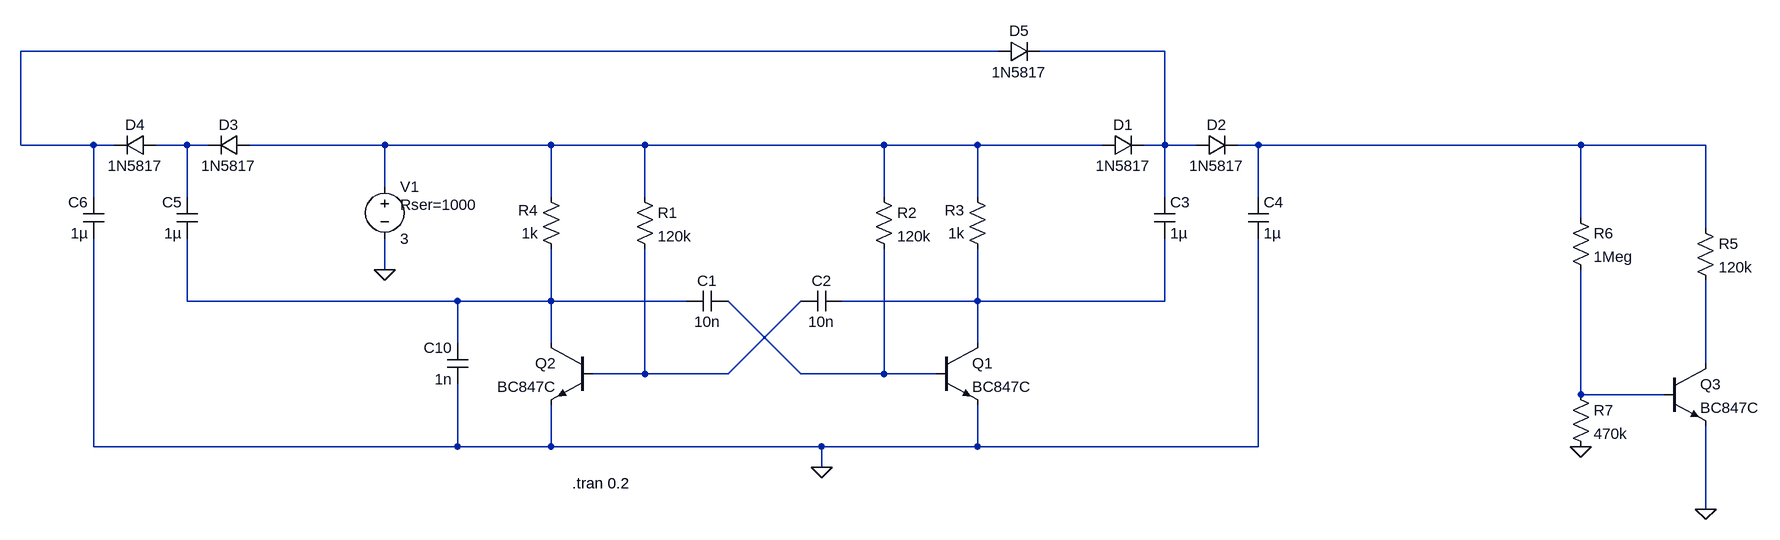
[diagram p0: schematic astableMultivibrator.asc]
astableMultivibrator.asc, the LTspice schematic file:
Version 4.1
SHEET 1 1956 680
WIRE 368 -336 -1136 -336
WIRE 624 -336 432 -336
WIRE -1136 -192 -1136 -336
WIRE -1024 -192 -1136 -192
WIRE -992 -192 -1024 -192
WIRE -880 -192 -928 -192
WIRE -848 -192 -880 -192
WIRE -576 -192 -784 -192
WIRE -320 -192 -576 -192
WIRE -176 -192 -320 -192
WIRE 192 -192 -176 -192
WIRE 336 -192 192 -192
WIRE 528 -192 336 -192
WIRE 624 -192 624 -336
WIRE 624 -192 592 -192
WIRE 672 -192 624 -192
WIRE 768 -192 736 -192
WIRE 1264 -192 768 -192
WIRE 1456 -192 1264 -192
WIRE -576 -128 -576 -192
WIRE -1024 -112 -1024 -192
WIRE -880 -112 -880 -192
WIRE -320 -112 -320 -192
WIRE -176 -112 -176 -192
WIRE 192 -112 192 -192
WIRE 336 -112 336 -192
WIRE 624 -112 624 -192
WIRE 768 -112 768 -192
WIRE 1264 -80 1264 -192
WIRE 1456 -64 1456 -192
WIRE -576 0 -576 -48
WIRE -880 48 -880 -48
WIRE -464 48 -880 48
WIRE -320 48 -320 -32
WIRE -320 48 -464 48
WIRE -112 48 -320 48
WIRE 336 48 336 -32
WIRE 336 48 128 48
WIRE 624 48 624 -48
WIRE 624 48 336 48
WIRE -464 112 -464 48
WIRE -320 112 -320 48
WIRE 336 112 336 48
WIRE 1456 144 1456 16
WIRE -176 160 -176 -32
WIRE -176 160 -256 160
WIRE -48 160 64 48
WIRE -48 160 -176 160
WIRE 64 160 -48 48
WIRE 192 160 192 -32
WIRE 192 160 64 160
WIRE 272 160 192 160
WIRE 1264 192 1264 0
WIRE 1392 192 1264 192
WIRE -1024 272 -1024 -48
WIRE -464 272 -464 176
WIRE -464 272 -1024 272
WIRE -320 272 -320 208
WIRE -320 272 -464 272
WIRE 96 272 -320 272
WIRE 336 272 336 208
WIRE 336 272 96 272
WIRE 768 272 768 -48
WIRE 768 272 336 272
WIRE 96 304 96 272
WIRE 1456 368 1456 240
FLAG 96 304 0
FLAG -576 0 0
FLAG 1456 368 0
FLAG 1264 272 0
SYMBOL npn 272 112 R0
SYMATTR InstName Q1
SYMATTR Value BC847C
SYMBOL npn -256 112 M0
SYMATTR InstName Q2
SYMATTR Value BC847C
SYMBOL cap -48 32 R90
WINDOW 0 0 32 VBottom 2
WINDOW 3 32 32 VTop 2
SYMATTR InstName C1
SYMATTR Value 10n
SYMBOL res -192 -128 R0
SYMATTR InstName R1
SYMATTR Value 120k
SYMBOL res 352 -16 R180
WINDOW 0 36 76 Left 2
WINDOW 3 36 40 Left 2
SYMATTR InstName R3
SYMATTR Value 1k
SYMBOL res -304 -16 R180
WINDOW 0 36 76 Left 2
WINDOW 3 36 40 Left 2
SYMATTR InstName R4
SYMATTR Value 1k
SYMBOL voltage -576 -144 R0
WINDOW 123 0 0 Left 0
WINDOW 39 24 44 Left 2
SYMATTR SpiceLine Rser=1000
SYMATTR InstName V1
SYMATTR Value 3
SYMBOL cap 128 32 R90
WINDOW 0 0 32 VBottom 2
WINDOW 3 32 32 VTop 2
SYMATTR InstName C2
SYMATTR Value 10n
SYMBOL res 176 -128 R0
SYMATTR InstName R2
SYMATTR Value 120k
SYMBOL diode 528 -176 R270
WINDOW 0 32 32 VTop 2
WINDOW 3 0 32 VBottom 2
SYMATTR InstName D1
SYMATTR Value 1N5817
SYMBOL cap 608 -112 R0
SYMATTR InstName C3
SYMATTR Value 1µ
SYMBOL diode 672 -176 R270
WINDOW 0 32 32 VTop 2
WINDOW 3 0 32 VBottom 2
SYMATTR InstName D2
SYMATTR Value 1N5817
SYMBOL cap 752 -112 R0
SYMATTR InstName C4
SYMATTR Value 1µ
SYMBOL diode -784 -176 M270
WINDOW 0 32 32 VTop 2
WINDOW 3 0 32 VBottom 2
SYMATTR InstName D3
SYMATTR Value 1N5817
SYMBOL cap -864 -112 M0
SYMATTR InstName C5
SYMATTR Value 1µ
SYMBOL diode -928 -176 M270
WINDOW 0 32 32 VTop 2
WINDOW 3 0 32 VBottom 2
SYMATTR InstName D4
SYMATTR Value 1N5817
SYMBOL cap -1008 -112 M0
SYMATTR InstName C6
SYMATTR Value 1µ
SYMBOL cap -448 112 M0
SYMATTR InstName C10
SYMATTR Value 1n
SYMBOL npn 1392 144 R0
SYMATTR InstName Q3
SYMATTR Value BC847C
SYMBOL res 1440 -80 R0
SYMATTR InstName R5
SYMATTR Value 120k
SYMBOL res 1248 -96 R0
SYMATTR InstName R6
SYMATTR Value 1Meg
SYMBOL res 1248 176 R0
SYMATTR InstName R7
SYMATTR Value 470k
SYMBOL diode 368 -320 R270
WINDOW 0 32 32 VTop 2
WINDOW 3 0 32 VBottom 2
SYMATTR InstName D5
SYMATTR Value 1N5817
TEXT -288 328 Left 2 !.tran 0.2

The netlist it stands for:
* astableMultivibrator.asc
Q1 N007 N010 0 0 BC847C
Q2 N006 N009 0 0 BC847C
C1 N010 N006 10n
R1 N004 N009 120k
R3 N007 N004 1k
R4 N006 N004 1k
V1 N004 0 3 Rser=1000
C2 N007 N009 10n
R2 N004 N010 120k
D1 N004 N002 1N5817
C3 N002 N007 1µ
D2 N002 N005 1N5817
C4 N005 0 1µ
D3 N004 N003 1N5817
C5 N003 N006 1µ
D4 N003 N001 1N5817
C6 N001 0 1µ
C10 N006 0 1n
Q3 N008 N011 0 0 BC847C
R5 N005 N008 120k
R6 N005 N011 1Meg
R7 N011 0 470k
D5 N001 N002 1N5817
.model D D
.lib standard.dio
.model NPN NPN
.model PNP PNP
.lib standard.bjt
.tran 0.2
.backanno
.end